# Altium project Error Detector with Competitive Output v1.0.PrjPCB
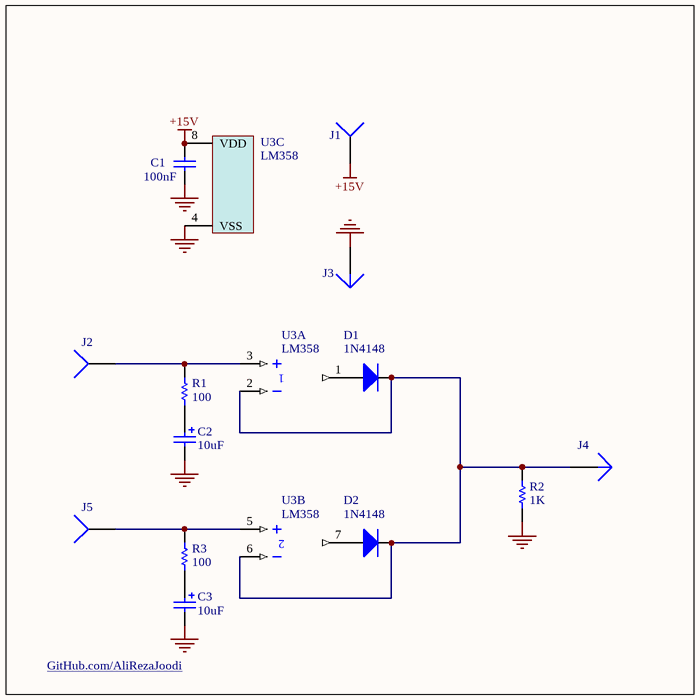
[diagram p0: Main.SchDoc]
1 sheet, 14 parts. Net scope: global (net labels, ports and power ports of the same name join across sheets).
Board file: PCB.PcbDoc

## Sheet Main.SchDoc
size 127 x 127 mm

### Parts
C1  100nF  [CAPNTO2.54-3.05x1.78A]
C2  10uF  [CAPPR2.5-5x6]
C3  10uF  [CAPPR2.5-5x6]
D1  1N4148  [DIODE0.4_Glass]
D2  1N4148  [DIODE0.4_Glass]
J1  COAX-F  [PIN1]  (value not drawn)
J2  COAX-F  [PIN1]  (value not drawn)
J3  COAX-M  [PIN1]  (value not drawn)
J4  COAX-M  [PIN1]  (value not drawn)
J5  COAX-F  [PIN1]  (value not drawn)
R1  100  [AXIAL-0.4]
R2  1K  [AXIAL-0.4]
R3  100  [AXIAL-0.4]
U3  LM358  [DIP8]  (parts A,B,C of 3)

### Nets
+15V: C1.2 J1.1(A) U3.8(VDD)
GND: C1.1 C2.2 C3.2 J3.1(A) R2.2 U3.4(VSS)
NetC2_1: C2.1 R1.2
NetC3_1: C3.1 R3.2
NetD1_1: D1.1(A) U3.1(OUT)
NetD1_2: D1.2(K) D2.2(K) J4.1(A) R2.1 U3.2(IN-) U3.6(IN-)
NetD2_1: D2.1(A) U3.7(OUT)
NetJ2_1: J2.1(A) R1.1 U3.3(IN+)
NetJ5_1: J5.1(A) R3.1 U3.5(IN+)

### Notes on the sheet
- (near C3) GitHub.com/AliRezaJoodi

### Library data of the parts
C1 = Cap: Capacitor; Manufacturer: Generic Components; Class I: Passive; Published: 8-Jun-2000; Revision: July-2002: Re-released for DXP Platform.; Publisher: Altium Limited; Class II: Capacitor
C2 C3 = Cap Pol1: Polarized Capacitor (Radial); Manufacturer: Generic Components; Class I: Passive; Published: 8-Jun-2000; Revision: July-2002: Re-released for DXP Platform.; Publisher: Altium Limited; Class II: Capacitor
D1 D2 = Diode: Default Diode; Manufacturer: Generic Components; Class I: Discrete; Class II: Diode - Switching; Published: 8-Jun-2000; Revision: July-2002: Re-released for DXP Platform.; Publisher: Altium Limited
J1 J2 J5 = COAX-F: Coax-F Connector; Manufacturer: Generic Components; Revision: July-2002: Re-released for DXP Platform.; Publisher: Altium Limited; Class I: Connector
J3 J4 = COAX-M: Coax-M Connector; Manufacturer: Generic Components; Revision: July-2002: Re-released for DXP Platform.; Publisher: Altium Limited; Class I: Connector
R1-R3 = Res1: Resistor; Published: 8-Jun-2000; LatestRevisionDate: 17-Jul-2002; LatestRevisionNote: Re-released for DXP Platform.; PackageReference: AXIAL-0.3; Publisher: Altium Limited
U3 = LM358: Dual Low-Power Operational Amplifier; Published: 17-Jul-2002; LatestRevisionDate: 13-Apr-2006; LatestRevisionNote: IPC-7351 Footprint Added.; DatasheetVersion: 1988; PackageReference: 751-02; Publisher: Altium Limited; PackageDescription: 8-Pin Small Outline Integrated Circuit 1.27 mm Pitch; Code_JEDEC: MS-012-AA; Code_IPC: SOIC127P600-8; ComponentLink1Description: Manufacturer Link; ComponentLink1URL: http://www.onsemi.com/site/products/parametrics/0,4446,251,00.html; ComponentLink2Description: Datasheet; ComponentLink2URL: http://www.onsemi.com/pub/Collateral/LM358-D.PDF